# Altium schematic sheet 04-AT86RF215IQ.SchDoc
size B; SheetNumber: 5; SheetTotal: 14
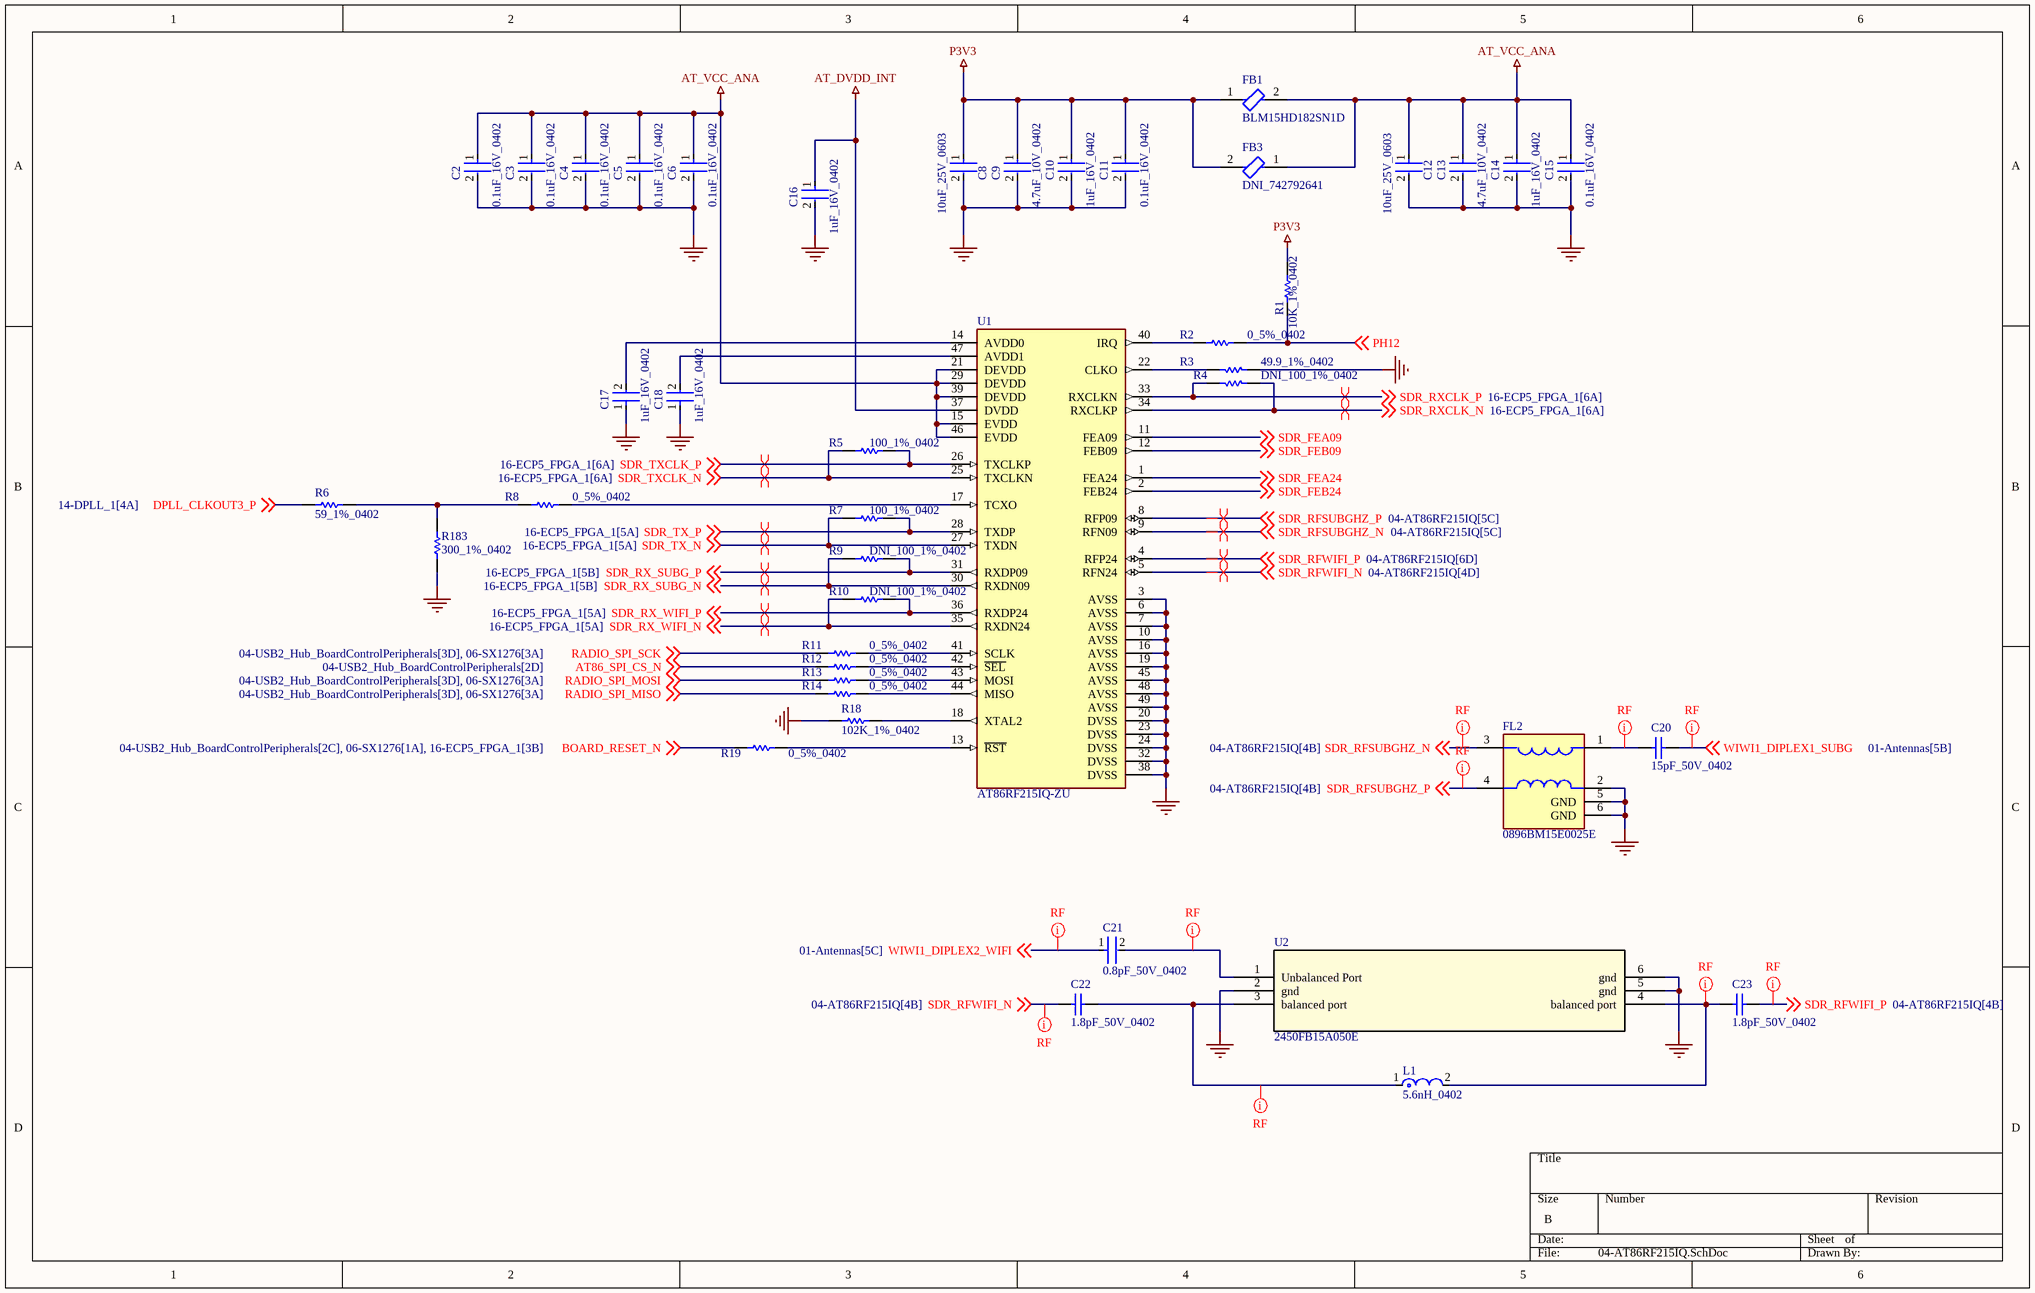
[diagram p0: 04-AT86RF215IQ.SchDoc]

## Parts
C2  0.1uF_16V_0402  [FP-C0402-BB-MFG]
C3  0.1uF_16V_0402  [FP-C0402-BB-MFG]
C4  0.1uF_16V_0402  [FP-C0402-BB-MFG]
C5  0.1uF_16V_0402  [FP-C0402-BB-MFG]
C6  0.1uF_16V_0402  [FP-C0402-BB-MFG]
C8  10uF_25V_0603  [FP-CL10-IPC_C]
C9  4.7uF_10V_0402  [FP-C1005-050-0_15-MFG]
C10  1uF_16V_0402  [FP-0402-L_1_0_0_05-W_0_5-IPC_A]
C11  0.1uF_16V_0402  [FP-C0402-BB-MFG]
C12  10uF_25V_0603  [FP-CL10-IPC_C]
C13  4.7uF_10V_0402  [FP-C1005-050-0_15-MFG]
C14  1uF_16V_0402  [FP-0402-L_1_0_0_05-W_0_5-IPC_A]
C15  0.1uF_16V_0402  [FP-C0402-BB-MFG]
C16  1uF_16V_0402  [FP-0402-L_1_0_0_05-W_0_5-IPC_A]
C17  1uF_16V_0402  [FP-0402-L_1_0_0_05-W_0_5-IPC_A]
C18  1uF_16V_0402  [FP-0402-L_1_0_0_05-W_0_5-IPC_A]
C20  15pF_50V_0402  [CAPC1005X55X25NL05T10]
C21  0.8pF_50V_0402  [FP-GJM155-0_05-IPC_A]
C22  1.8pF_50V_0402  [CAPC1005X55X25LL05T10]
C23  1.8pF_50V_0402  [CAPC1005X55X25LL05T10]
FB1  BLM15HD182SN1D  [FP-BLM15-0_05-MFG]
FB3  DNI_742792641  [FP-742792641-MFG]  (no BOM)
FL2  0896BM15E0025E  [FP-0896BM15E0025E-MFG]
L1  5.6nH_0402  [FP-LQG15HH_02-IPC_A]
R1  10K_1%_0402  [RESC1005X40X25NL10T10]
R2  0_5%_0402  [RESC1005X40X25NL05T10]
R3  49.9_1%_0402  [RESC1005X40X25NL10T10]
R4  DNI_100_1%_0402  [RESC1005X40X25NL05T10]  (no BOM)
R5  100_1%_0402  [RESC1005X40X25NL05T10]
R6  59_1%_0402  [RESC1005X40X25ML10T10]
R7  100_1%_0402  [RESC1005X40X25NL05T10]
R8  0_5%_0402  [RESC1005X40X25NL05T10]
R9  DNI_100_1%_0402  [RESC1005X40X25NL05T10]  (no BOM)
R10  DNI_100_1%_0402  [RESC1005X40X25NL05T10]  (no BOM)
R11  0_5%_0402  [RESC1005X40X25NL05T10]
R12  0_5%_0402  [RESC1005X40X25NL05T10]
R13  0_5%_0402  [RESC1005X40X25NL05T10]
R14  0_5%_0402  [RESC1005X40X25NL05T10]
R18  102K_1%_0402  [RESC1005X40X25ML05T10]
R19  0_5%_0402  [RESC1005X40X25NL05T10]
R183  300_1%_0402  [RESC1005X40X25LL10T10]
U1  AT86RF215IQ-ZU  [FP-AT86RF215IQ-ZU-MFG]
U2  2450FB15A050E  [2450FB15A050E_JOT]

## Nets
AT_DVDD_INT: C16.1 U1.37(DVDD)
AT_VCC_ANA: C2.1 C3.1 C4.1 C5.1 C6.1 C12.1 C13.1 C14.1 C15.1 FB1.2 FB3.1 U1.15(EVDD) U1.21(DEVDD) U1.29(DEVDD) U1.39(DEVDD) U1.46(EVDD)
GND: C2.2 C3.2 C4.2 C5.2 C6.2 C8.2 C9.2 C10.2 C11.2 C12.2 C13.2 C14.2 C15.2 C16.2 C17.1 C18.1 FL2.2(GND) FL2.5(GND) FL2.6(GND) R3.2 R18.1 R183.1 U1.3(AVSS) U1.6(AVSS) U1.7(AVSS) U1.10(AVSS) U1.16(AVSS) U1.19(AVSS) U1.20(DVSS) U1.23(DVSS) U1.24(DVSS) U1.32(DVSS) U1.38(DVSS) U1.45(AVSS) U1.48(AVSS) U1.49(AVSS) U2.2(gnd) U2.5(gnd) U2.6(gnd)
P3V3: C8.1 C9.1 C10.1 C11.1 FB1.1 FB3.2 R1.2
AT86_SPI_CS_N: R12.1 ; off-sheet AT86_SPI_CS_N
BOARD_RESET_N: R19.1 ; off-sheet BOARD_RESET_N
DPLL_CLKOUT3_P: R6.1 ; off-sheet DPLL_CLKOUT3_P
PH12: R1.1 R2.2 ; off-sheet PH12
RADIO_SPI_MISO: R14.1 ; off-sheet RADIO_SPI_MISO
RADIO_SPI_MOSI: R13.1 ; off-sheet RADIO_SPI_MOSI
RADIO_SPI_SCK: R11.1 ; off-sheet RADIO_SPI_SCK
SDR_FEA09: U1.11(FEA09) ; off-sheet SDR_FEA09
SDR_FEA24: U1.1(FEA24) ; off-sheet SDR_FEA24
SDR_FEB09: U1.12(FEB09) ; off-sheet SDR_FEB09
SDR_FEB24: U1.2(FEB24) ; off-sheet SDR_FEB24
SDR_RFSUBGHZ_N: FL2.3(1_Balanced_Port) U1.9(RFN09) ; off-sheet SDR_RFSUBGHZ_N
SDR_RFSUBGHZ_P: FL2.4(2_Balanced_Port) U1.8(RFP09) ; off-sheet SDR_RFSUBGHZ_P
SDR_RFWIFI_N: C22.1 U1.5(RFN24) ; off-sheet SDR_RFWIFI_N
SDR_RFWIFI_P: C23.2 U1.4(RFP24) ; off-sheet SDR_RFWIFI_P
SDR_RX_SUBG_N: R9.1 U1.30(RXDN09) ; off-sheet SDR_RX_SUBG_N
SDR_RX_SUBG_P: R9.2 U1.31(RXDP09) ; off-sheet SDR_RX_SUBG_P
SDR_RX_WIFI_N: R10.1 U1.35(RXDN24) ; off-sheet SDR_RX_WIFI_N
SDR_RX_WIFI_P: R10.2 U1.36(RXDP24) ; off-sheet SDR_RX_WIFI_P
SDR_RXCLK_N: R4.1 U1.34(RXCLKP) ; off-sheet SDR_RXCLK_N
SDR_RXCLK_P: R4.2 U1.33(RXCLKN) ; off-sheet SDR_RXCLK_P
SDR_TX_N: R7.1 U1.27(TXDN) ; off-sheet SDR_TX_N
SDR_TX_P: R7.2 U1.28(TXDP) ; off-sheet SDR_TX_P
SDR_TXCLK_N: R5.1 U1.25(TXCLKN) ; off-sheet SDR_TXCLK_N
SDR_TXCLK_P: R5.2 U1.26(TXCLKP) ; off-sheet SDR_TXCLK_P
WIWI1_DIPLEX1_SUBG: C20.2 ; off-sheet WIWI1_DIPLEX1_SUBG
WIWI1_DIPLEX2_WIFI: C21.1 ; off-sheet WIWI1_DIPLEX2_WIFI
NetC17_2: C17.2 U1.14(AVDD0)
NetC18_2: C18.2 U1.47(AVDD1)
NetC20_1: C20.1 FL2.1(Unbalanced_Port)
NetC21_2: C21.2 U2.1(Unbalanced_Port)
NetC22_2: C22.2 L1.1 U2.3(balanced_port)
NetC23_1: C23.1 L1.2 U2.4(balanced_port)
NetR2_1: R2.1 U1.40(IRQ)
NetR3_1: R3.1 U1.22(CLKO)
NetR6_2: R6.2 R8.1 R183.2
NetR8_2: R8.2 U1.17(TCXO)
NetR11_2: R11.2 U1.41(SCLK)
NetR12_2: R12.2 U1.42(~{SEL})
NetR13_2: R13.2 U1.43(MOSI)
NetR14_2: R14.2 U1.44(MISO)
NetR18_2: R18.2 U1.18(XTAL2)
NetR19_2: R19.2 U1.13(~{RST})

## Layout directives
differential pair: SDR_RFSUBGHZ_N, SDR_RFSUBGHZ_P, SDR_RFWIFI_N, SDR_RFWIFI_P, SDR_RX_SUBG_N, SDR_RX_SUBG_P, SDR_RX_WIFI_N, SDR_RX_WIFI_P, SDR_RXCLK_N, SDR_RXCLK_P, SDR_TX_N, SDR_TX_P, SDR_TXCLK_N, SDR_TXCLK_P
net class RF: NetC20_1, NetC21_2, NetC22_2, NetC23_1, SDR_RFSUBGHZ_N, SDR_RFSUBGHZ_P, SDR_RFWIFI_N, SDR_RFWIFI_P, WIWI1_DIPLEX1_SUBG, WIWI1_DIPLEX2_WIFI

## Library data of the parts
C2-C6 C11 C15 = CMP-1034-02068-3: CAP CER 0.1UF 16V 5% X7R 0402; Manufacturer: Kemet; Manufacturer Part Number: C0402C104J4RACTU; Value: 0.10 μF; Temperature Coefficient: 15%; Tolerance: 0.05; Material: Ceramic; ComponentLink2URL: https://content.kemet.com/datasheets/KEM_C1002_X7R_SMD.pdf; Automotive: No; Device Class L2: Capacitors; Temperature: -55°C to +125°C; RoHS: TRUE; Voltage Rating: 16 V; ComponentLink2Description: Datasheet; Device Class L3: Ceramic Capacitors; Temperature Range Low: -55°C; Ipc Land Pattern Name: CAPC10050X50; Device Class L1: Passive Components; Temperature Range High: +125°C; Package: C0402-BB; Capacitance: 0.10 μF; Category: Cap; Mouser Description: CAP CER 0.1UF 16V X7R 0402; Height: 0.55mm; Digikey Description: CAP CER 0.1UF 16V 5% X7R 0402; Octopart: https://octopart.com/c0402c104j4ractu-kemet-12573893; Temperature Characteristic: X7R; Lead Free: Yes
C8 C12 = CMP-13271-004224-1: Cap Ceramic 10uF 25V X5R ±20% Pad SMD 0603 +85°C T/R; Width: 0.031inch; Voltage Rating: 25V; Length: 0.063inch; Case Code (Metric): 1608; Dielectric: X5R; Termination: Wraparound; Capacitance: 10uF; Lead Free: Lead Free; Mount: Surface Mount; Package Quantity: 1; Case Code (Imperial): 0603; Thickness: 0.035inch; Packaging: Tape and Reel; Contact Plating: Tin; Min Operating Temperature: -55°C; Tolerance: 20%; Max Operating Temperature: 85°C; Case/Package: 0603
C9 C13 = CMP-2000-05997-2: CAP CER 4.7UF 10V X5R 0402; Dielectric Material: Ceramic; Tolerance: 10%; Series: C; Package Quantity: 10000; Max Operating Temperature: 85°C; Case Code (Imperial): 0402; Lead Free: Lead Free; Voltage Rating (DC): 10V; Packaging: Cut Tape; Voltage Rating: 10V; Min Operating Temperature: -55°C; Dielectric: X5R; Thickness: 0.022inch; Width: 0.02inch; Case/Package: 0402; Case Code (Metric): 1005; Capacitance: 4.7uF; Length: 0.039inch; RoHS Compliant: Yes; REACH SVHC: No SVHC; Mount: Surface Mount
C10 C14 C16-C18 = CMP-14477-000104-2: None; Tolerance: 10%; Voltage Rating: 16V; Dielectric: X5R; Capacitance: 1uF; Packaging: Tape and Reel; Depth: 0.5mm; Mount: Surface Mount; Thickness: 0.022inch; Package Quantity: 1; Min Operating Temperature: -55°C; Series: M; Voltage Rating (DC): 16V; Termination: SMD/SMT; Case/Package: 0402; Number of Pins: 2; Case Code (Imperial): 0402; Length: 1mm; Halogen Free: Halogen Free; Case Code (Metric): 1005; Width: 0.02inch; RoHS Compliant: Yes; Radiation Hardening: No; Max Operating Temperature: 85°C; Height: 0.5mm; Construction: Flat
C20 = CMP-2008-04267-1: Part Number: GRM1555C1H150JZ01D; Manufacturer: Murata
C21 = CMP-2008-03912-2: Multi-Layer Ceramic Capacitor 0.8pF C0G  ±0.1pF 0402 Paper T/R; Voltage: 50V; Height: 0.5mm; Min Operating Temperature: -55°C; Mount: Surface Mount; Length: 1mm; Packaging: Tape and Reel; Package Quantity: 1; Max Operating Temperature: 125°C; Dielectric: C0G; Case Code (Imperial): 0402; Voltage Rating (DC): 50V; Voltage Rating: 50V; Case Code (Metric): 1005; Depth: 0.5mm; Case/Package: 0402; Width: 0.02inch; Termination: SMD/SMT; Thickness: 0.022inch; Capacitance: 0.8pF; Radiation Hardening: No; Lead Free: Lead Free
C22 C23 = CMP-2008-03916-1: Part Number: GRM1555C1H1R8CA01D; Manufacturer: Murata
FB1 = CMP-0686-00276-4: Chip Ferrite Bead, 0402, 1800Ω @ 100MHz, 2.2Ω, 25%, 200mA; Impedance: 1.8kR; Number of Lines: 1; DC Resistance (DCR): 2.2R; Lead Free: Lead Free; Material: Ferrite; REACH SVHC: No SVHC; Current Rating: 200mA; Length: 1mm; Width: 0.5mm; Depth: 0.5mm; Max Operating Temperature: 125°C; Max DC Current: 200mA; Max Current Rating: 200mA; Case Code (Metric): 1005; Package Quantity: 1; Radiation Hardening: No; Number of Pins: 2; Tolerance: 25%; Number of Circuits: 1; Test Frequency: 100MHz; Termination: SMD/SMT; Military Standard: Not; Core Material: Ferrite; Height: 0.5mm; Case Code (Imperial): 0402; Packaging: Tape and Reel; Case/Package: 0402; DC Current: 200mA; Min Operating Temperature: -55°C
FB3 = CMP-0220-00171-2: FERRITE BEAD 300 OHM 0603 1LN; Inductance: 18nH; Max DC Current: 2A; Number of Lines: 1; Test Frequency: 100MHz; Impedance: 300R; DC Resistance (DCR): 150mR; Tolerance: 25%; Case Code (Metric): 1608; Core Material: Ferrite; Length: 1.6mm; Lead Free: Lead Free; Series: WE-CBF; Min Operating Temperature: -55°C; RoHS Compliant: Yes; Case/Package: SMD/SMT; Material: Ferrite; Max Operating Temperature: 125°C; Termination: SMD/SMT; Packaging: Tape and Reel; Weight: 0.000141oz; Case Code (Imperial): 0603; Width: 0.8mm; Mount: Surface Mount; Max Current Rating: 2A; Package Quantity: 1; Depth: 0.8mm; Current Rating: 2A; Height: 0.8mm
FL2 = CMP-56495-000001-1: BALUN 863MHZ-928MHZ 50/50 0805; Manufacturer: Johanson; Insertion Loss: 1.8dB; Frequency: 895.5MHz; Bandwidth: 863-928MHz; Filter Type: Low Pass; Automotive: No; Manufacturer Part Number: 0896BM15E0025E; Temperature Range Low: -40°C; Height: 1.05mm; Digikey Description: BALUN 863MHZ-928MHZ 50/50 0805; Mouser Description: Signal Conditioning 863/928MHz BALUN/FILTER; Category: Filter; ComponentLink2Description: Datasheet; Temperature: -40°C to +125°C; Lead Free: Yes; Temperature Range High: +125°C; ComponentLink2URL: https://www.johansontechnology.com/datasheets/0896BM15E0025/0896BM15E0025.pdf; Package: 0896BM15E0025E; Device Class L2: EMI / RFI Components; Device Class L3: RF; RoHS: TRUE; Octopart: https://octopart.com/0896bm15e0025e-johanson-71691697; Device Class L1: Passive Components
L1 = CMP-06042-000284-1: Multilayer type RF Inductor 5.6nH ±0.3nH 0.18Ω 600mA 0402; Core Material: Air; DC Current: 300mA; Shielding: Unshielded; Test Frequency: 100MHz; Self Resonant Frequency: 5.3GHz; Q Factor: 8; DC Resistance (DCR): 260mR; Package Quantity: 1; Number of Pins: 2; Height: 0.02inch; Mount: Surface Mount; Termination: SMD/SMT; Case/Package: 0402; Case Code (Metric): 1005; Packaging: Tape and Reel; Min Operating Temperature: -55°C; Max DC Current: 300mA; Width: 0.02inch; Case Code (Imperial): 0402; Lead Free: Lead Free; Inductance: 5.6nH; Max Operating Temperature: 125°C; REACH SVHC: No SVHC; Radiation Hardening: No; Height - Seated (Max): 0.022inch; Depth: 0.55mm; Military Standard: Not; Length: 1mm; Current Rating: 300mA
R1 = CMP-2002-04694-1: Manufacturer: Bourns; Part Number: CR0402-FX-1002GLF
R2 R8 R11-R14 R19 = CMP-2002-06457-1: Manufacturer: Panasonic; Part Number: ERJ-U020R00X
R3 = CMP-2002-04448-1: Part Number: RK73H1ETTP49R9F; Manufacturer: KOA Speer
R4 R5 R7 R9 R10 = CMP-2002-07853-1: Manufacturer: Yageo; Part Number: RC0402FR-13100RL
R6 = CMP-2002-04479-1: Manufacturer: KOA Speer; Part Number: RK73H1ETTP59R0F
R18 = CMP-2002-07345-1: Manufacturer: Yageo; Part Number: RC0402FR-07102KL
R183 = CMP-2002-06121-1: Part Number: MC00625W04021300R; Manufacturer: Multicomp
U1 = CMP-06331-000021-1: IC RF TXRX 802.15.4 48VFQFN; Manufacturer: Microchip; Data Rate: 2.4Mbits/s; Min Supply Voltage: 1.8V; Standoff Height: 0mm; Interface: SPI,Other; Sensitivity: -123dBm; Max Supply Voltage: 3.6V; Max Frequency: 2483.5MHz; Temperature Range High: +85°C; ComponentLink2URL: http://ww1.microchip.com/downloads/en/devicedoc/atmel-42415-wireless-at86rf215_datasheet.pdf; Lead Free: Yes; Digikey Description: IC RF TXRX 802.15.4 48VFQFN; Temperature: -40°C to +85°C; RoHS: TRUE; ComponentLink2Description: Datasheet; Height: 0.9mm; Temperature Range Low: -40°C; Manufacturer Part Number: AT86RF215IQ-ZU; Footprint Url: http://ww1.microchip.com/downloads/en/appnotes/atmel-8826-seeprom-pcb-mounting-guidelines-surface-mount-packages-applicationnote.pdf; Category: IC; Automotive: No; Ipc Land Pattern Name: QFN50P700X700X85-48; Device Class L1: Integrated Circuits (ICs); Octopart: https://octopart.com/at86rf215iq-zu-microchip-77758620; Package: QFN48; Device Class L2: RF Semiconductors and Devices; Device Class L3: Transceivers
U2 = 2450FB15A050E: No Description Available; Mfr_Name: Johanson Technology; RefDes: RefDes; Type: Type